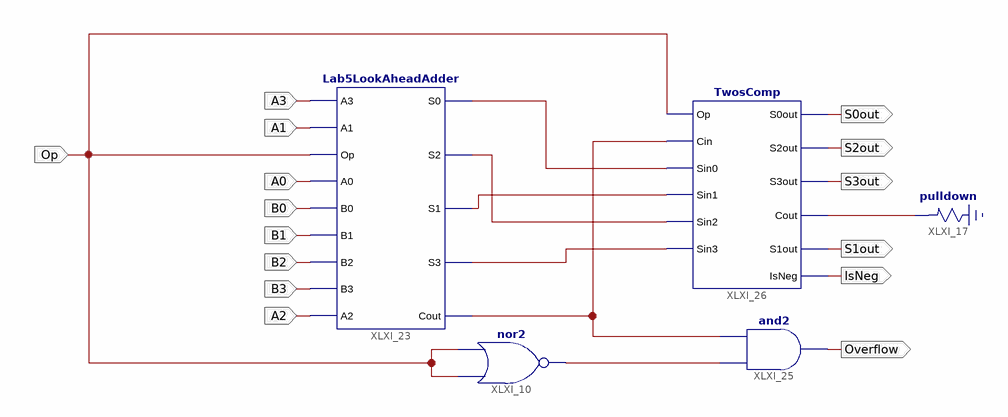
[diagram p0: schematic sheet 1]
// Xilinx ISE schematic Lab5Exp4.sch (spartan3e) as structural Verilog: 5 symbols, 15 ports
module Lab5Exp4 (
  input  Op,
  input  A3,
  input  A1,
  input  A0,
  input  B0,
  input  B1,
  input  B2,
  input  B3,
  input  A2,
  output S0out,
  output S2out,
  output S3out,
  output S1out,
  output IsNeg,
  output Overflow
);

  wire XLXN_40, XLXN_47, XLXN_50, XLXN_51, XLXN_52, XLXN_53, XLXN_72;

  nor XLXI_10 (XLXN_47, Op, Op);
  \pulldown  XLXI_17 (.O(XLXN_40));
  Lab5LookAheadAdder XLXI_23 (
    .A3(A3), .A1(A1), .Op(Op), .A0(A0), .B0(B0), .B1(B1), .B2(B2), .B3(B3), .A2(A2), .S0(XLXN_51),
    .S2(XLXN_52), .S1(XLXN_53), .S3(XLXN_50), .Cout(XLXN_72));
  and XLXI_25 (Overflow, XLXN_47, XLXN_72);
  TwosComp XLXI_26 (
    .Sin0(XLXN_51), .Sin1(XLXN_53), .Sin2(XLXN_52), .Sin3(XLXN_50), .Op(Op), .Cin(XLXN_72), .IsNeg(IsNeg),
    .S0out(S0out), .S2out(S2out), .S1out(S1out), .S3out(S3out), .Cout(XLXN_40));
endmodule
